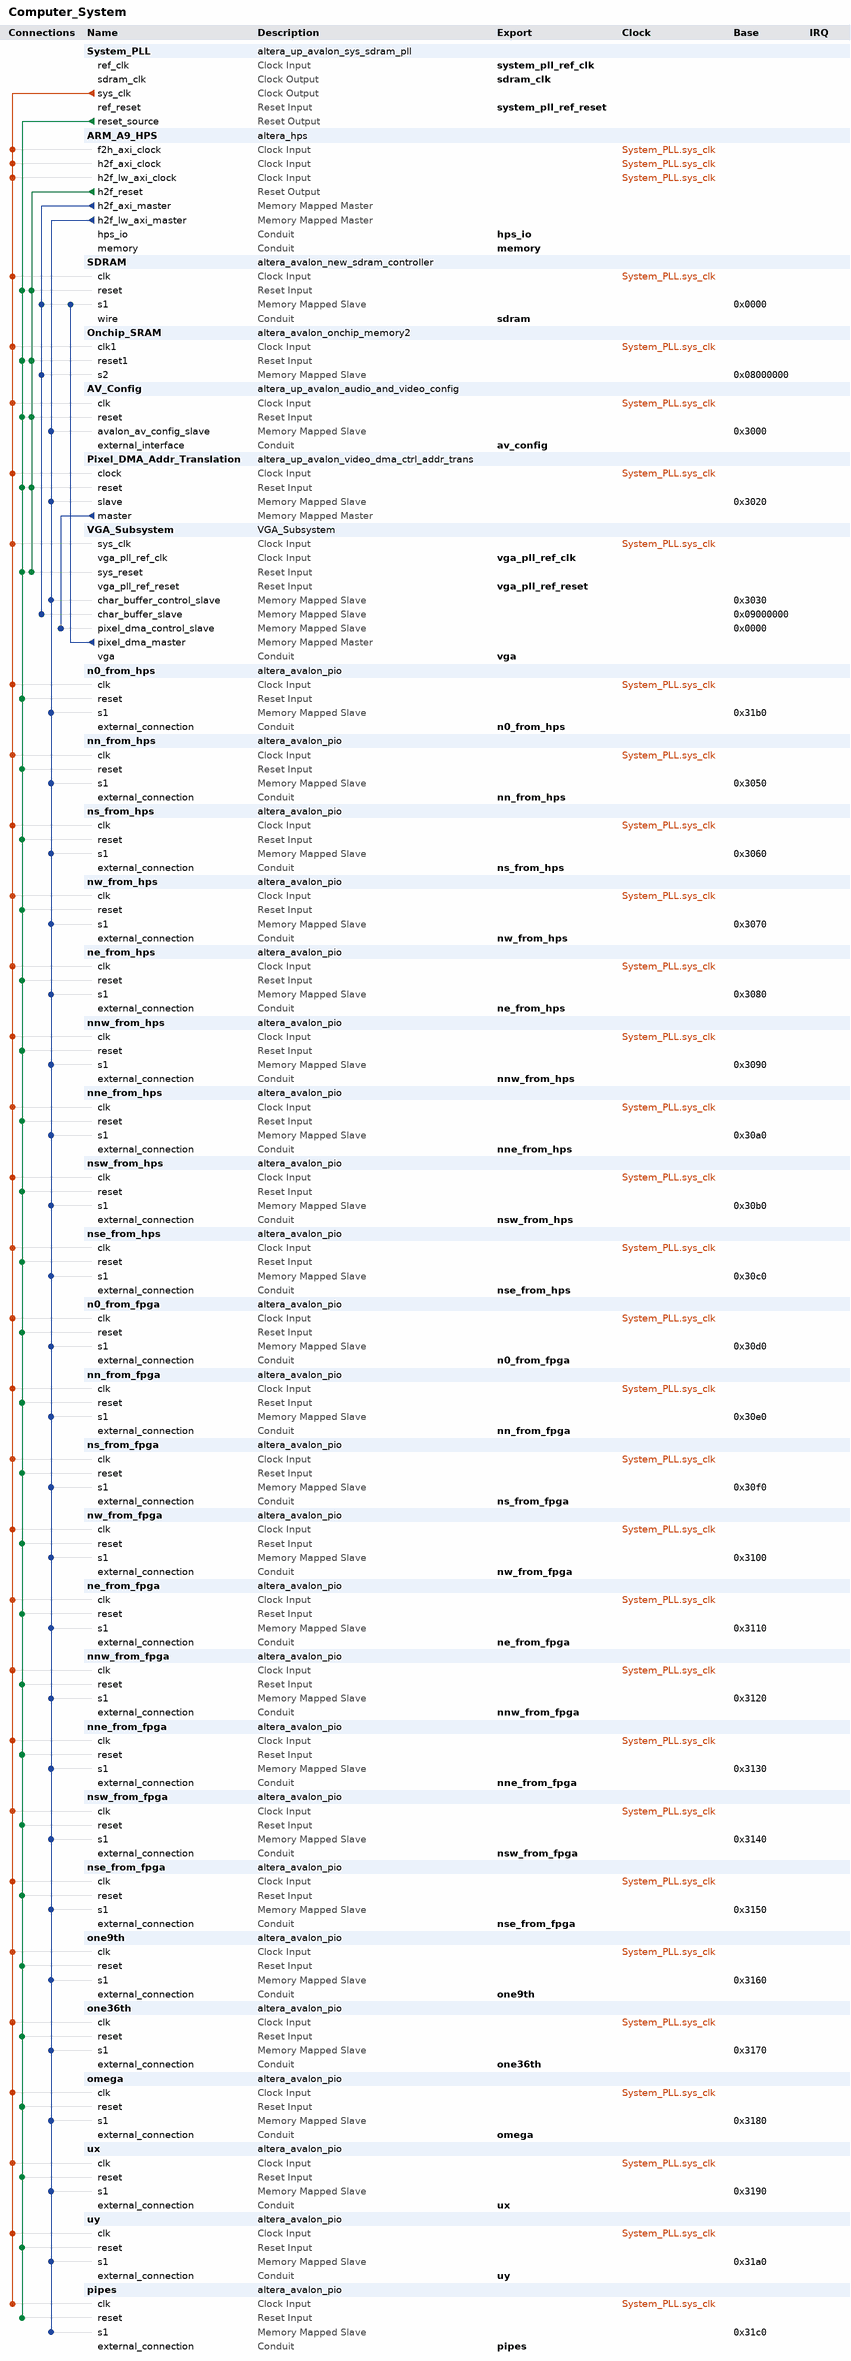
[diagram p0: system contents]
# Platform Designer (Qsys) system Computer_System, Cyclone V 5CSEMA5F31C6
# Parameters at their usual value, and those the tool derives, are not listed.
package require -exact qsys 18.1
create_system Computer_System
set_project_property DEVICE_FAMILY {Cyclone V}
set_project_property DEVICE 5CSEMA5F31C6

add_instance System_PLL altera_up_avalon_sys_sdram_pll 18.0
set_instance_parameter_value System_PLL CV_boards DE1-SoC
set_instance_parameter_value System_PLL gui_outclk 100.0
set_instance_parameter_value System_PLL gui_refclk 50.0

add_instance ARM_A9_HPS altera_hps 18.1
set_instance_parameter_value ARM_A9_HPS EMAC1_Mode RGMII
set_instance_parameter_value ARM_A9_HPS EMAC1_PinMuxing {HPS I/O Set 0}
set_instance_parameter_value ARM_A9_HPS F2SCLK_COLDRST_Enable false
set_instance_parameter_value ARM_A9_HPS F2SCLK_DBGRST_Enable false
set_instance_parameter_value ARM_A9_HPS F2SCLK_WARMRST_Enable false
set_instance_parameter_value ARM_A9_HPS F2SINTERRUPT_Enable true
set_instance_parameter_value ARM_A9_HPS F2S_Width 2
set_instance_parameter_value ARM_A9_HPS FPGA_PERIPHERAL_OUTPUT_CLOCK_FREQ_EMAC0_GTX_CLK 125
set_instance_parameter_value ARM_A9_HPS FPGA_PERIPHERAL_OUTPUT_CLOCK_FREQ_EMAC0_MD_CLK 100.0
set_instance_parameter_value ARM_A9_HPS FPGA_PERIPHERAL_OUTPUT_CLOCK_FREQ_EMAC1_GTX_CLK 125
set_instance_parameter_value ARM_A9_HPS FPGA_PERIPHERAL_OUTPUT_CLOCK_FREQ_EMAC1_MD_CLK 100.0
set_instance_parameter_value ARM_A9_HPS HPS_PROTOCOL DDR3
set_instance_parameter_value ARM_A9_HPS I2C0_Mode I2C
set_instance_parameter_value ARM_A9_HPS I2C0_PinMuxing {HPS I/O Set 0}
set_instance_parameter_value ARM_A9_HPS I2C1_Mode I2C
set_instance_parameter_value ARM_A9_HPS I2C1_PinMuxing {HPS I/O Set 0}
set_instance_parameter_value ARM_A9_HPS LWH2F_Enable true
set_instance_parameter_value ARM_A9_HPS MEM_BANKADDR_WIDTH 3
set_instance_parameter_value ARM_A9_HPS MEM_CLK_FREQ 400.0
set_instance_parameter_value ARM_A9_HPS MEM_COL_ADDR_WIDTH 10
set_instance_parameter_value ARM_A9_HPS MEM_DQ_WIDTH 32
set_instance_parameter_value ARM_A9_HPS MEM_DRV_STR RZQ/7
set_instance_parameter_value ARM_A9_HPS MEM_ROW_ADDR_WIDTH 15
set_instance_parameter_value ARM_A9_HPS MEM_RTT_NOM RZQ/4
set_instance_parameter_value ARM_A9_HPS MEM_RTT_WR RZQ/4
set_instance_parameter_value ARM_A9_HPS MEM_TCL 11
set_instance_parameter_value ARM_A9_HPS MEM_TFAW_NS 30.0
set_instance_parameter_value ARM_A9_HPS MEM_TRAS_NS 35.0
set_instance_parameter_value ARM_A9_HPS MEM_TRCD_NS 13.75
set_instance_parameter_value ARM_A9_HPS MEM_TRFC_NS 260.0
set_instance_parameter_value ARM_A9_HPS MEM_TRP_NS 13.75
set_instance_parameter_value ARM_A9_HPS MEM_VENDOR JEDEC
set_instance_parameter_value ARM_A9_HPS MEM_WTCL 8
set_instance_parameter_value ARM_A9_HPS QSPI_Mode {1 SS}
set_instance_parameter_value ARM_A9_HPS QSPI_PinMuxing {HPS I/O Set 0}
set_instance_parameter_value ARM_A9_HPS REF_CLK_FREQ 25.0
set_instance_parameter_value ARM_A9_HPS S2FCLK_USER2CLK 5
set_instance_parameter_value ARM_A9_HPS S2F_Width 3
set_instance_parameter_value ARM_A9_HPS SDIO_Mode {4-bit Data}
set_instance_parameter_value ARM_A9_HPS SDIO_PinMuxing {HPS I/O Set 0}
set_instance_parameter_value ARM_A9_HPS SPIM1_Mode {Single Slave Select}
set_instance_parameter_value ARM_A9_HPS SPIM1_PinMuxing {HPS I/O Set 0}
set_instance_parameter_value ARM_A9_HPS STM_Enable false
set_instance_parameter_value ARM_A9_HPS TIMING_BOARD_AC_SKEW 0.03
set_instance_parameter_value ARM_A9_HPS TIMING_BOARD_AC_TO_CK_SKEW 0.0
set_instance_parameter_value ARM_A9_HPS TIMING_BOARD_DQ_TO_DQS_SKEW 0.0
set_instance_parameter_value ARM_A9_HPS TIMING_BOARD_MAX_CK_DELAY 0.03
set_instance_parameter_value ARM_A9_HPS TIMING_BOARD_MAX_DQS_DELAY 0.02
set_instance_parameter_value ARM_A9_HPS TIMING_BOARD_SKEW_BETWEEN_DQS 0.08
set_instance_parameter_value ARM_A9_HPS TIMING_BOARD_SKEW_CKDQS_DIMM_MAX 0.16
set_instance_parameter_value ARM_A9_HPS TIMING_BOARD_SKEW_CKDQS_DIMM_MIN 0.09
set_instance_parameter_value ARM_A9_HPS TIMING_BOARD_SKEW_WITHIN_DQS 0.01
set_instance_parameter_value ARM_A9_HPS TIMING_TDH 65
set_instance_parameter_value ARM_A9_HPS TIMING_TDQSCK 255
set_instance_parameter_value ARM_A9_HPS TIMING_TDQSQ 125
set_instance_parameter_value ARM_A9_HPS TIMING_TDS 30
set_instance_parameter_value ARM_A9_HPS TIMING_TIH 140
set_instance_parameter_value ARM_A9_HPS TIMING_TIS 180
set_instance_parameter_value ARM_A9_HPS TIMING_TQSH 0.4
set_instance_parameter_value ARM_A9_HPS UART0_Mode {No Flow Control}
set_instance_parameter_value ARM_A9_HPS UART0_PinMuxing {HPS I/O Set 0}
set_instance_parameter_value ARM_A9_HPS USB1_Mode SDR
set_instance_parameter_value ARM_A9_HPS USB1_PinMuxing {HPS I/O Set 0}
set_instance_parameter_value ARM_A9_HPS desired_cfg_clk_mhz 100.0
set_instance_parameter_value ARM_A9_HPS desired_qspi_clk_mhz 400.0

add_instance SDRAM altera_avalon_new_sdram_controller 18.1
set_instance_parameter_value SDRAM TAC 5.5
set_instance_parameter_value SDRAM TRCD 20.0
set_instance_parameter_value SDRAM TRP 20.0
set_instance_parameter_value SDRAM casLatency 3
set_instance_parameter_value SDRAM columnWidth 10
set_instance_parameter_value SDRAM dataWidth 16
set_instance_parameter_value SDRAM generateSimulationModel true
set_instance_parameter_value SDRAM model single_Micron_MT48LC4M32B2_7_chip
set_instance_parameter_value SDRAM numberOfBanks 4
set_instance_parameter_value SDRAM numberOfChipSelects 1
set_instance_parameter_value SDRAM powerUpDelay 100.0
set_instance_parameter_value SDRAM refreshPeriod 15.625
set_instance_parameter_value SDRAM rowWidth 13

add_instance Onchip_SRAM altera_avalon_onchip_memory2 18.1
set_instance_parameter_value Onchip_SRAM dataWidth 8
set_instance_parameter_value Onchip_SRAM dualPort true
set_instance_parameter_value Onchip_SRAM initMemContent false
set_instance_parameter_value Onchip_SRAM initializationFileName onchip_mem.hex
set_instance_parameter_value Onchip_SRAM memorySize 131072
set_instance_parameter_value Onchip_SRAM singleClockOperation true

add_instance AV_Config altera_up_avalon_audio_and_video_config 18.0
set_instance_parameter_value AV_Config audio_in {Microphone to ADC}
set_instance_parameter_value AV_Config bit_length 32
set_instance_parameter_value AV_Config board DE1-SoC
set_instance_parameter_value AV_Config line_in_bypass false
set_instance_parameter_value AV_Config sampling_rate {48 kHz}

add_instance Pixel_DMA_Addr_Translation altera_up_avalon_video_dma_ctrl_addr_trans 18.0

add_instance VGA_Subsystem VGA_Subsystem 1.0

add_instance n0_from_hps altera_avalon_pio 18.1
set_instance_parameter_value n0_from_hps direction Output
set_instance_parameter_value n0_from_hps width 32

add_instance nn_from_hps altera_avalon_pio 18.1
set_instance_parameter_value nn_from_hps direction Output
set_instance_parameter_value nn_from_hps width 32

add_instance ns_from_hps altera_avalon_pio 18.1
set_instance_parameter_value ns_from_hps direction Output
set_instance_parameter_value ns_from_hps width 32

add_instance nw_from_hps altera_avalon_pio 18.1
set_instance_parameter_value nw_from_hps direction Output
set_instance_parameter_value nw_from_hps width 32

add_instance ne_from_hps altera_avalon_pio 18.1
set_instance_parameter_value ne_from_hps direction Output
set_instance_parameter_value ne_from_hps width 32

add_instance nnw_from_hps altera_avalon_pio 18.1
set_instance_parameter_value nnw_from_hps direction Output
set_instance_parameter_value nnw_from_hps width 32

add_instance nne_from_hps altera_avalon_pio 18.1
set_instance_parameter_value nne_from_hps direction Output
set_instance_parameter_value nne_from_hps width 32

add_instance nsw_from_hps altera_avalon_pio 18.1
set_instance_parameter_value nsw_from_hps direction Output
set_instance_parameter_value nsw_from_hps width 32

add_instance nse_from_hps altera_avalon_pio 18.1
set_instance_parameter_value nse_from_hps direction Output
set_instance_parameter_value nse_from_hps width 32

add_instance n0_from_fpga altera_avalon_pio 18.1
set_instance_parameter_value n0_from_fpga direction Input
set_instance_parameter_value n0_from_fpga width 32

add_instance nn_from_fpga altera_avalon_pio 18.1
set_instance_parameter_value nn_from_fpga direction Input
set_instance_parameter_value nn_from_fpga width 32

add_instance ns_from_fpga altera_avalon_pio 18.1
set_instance_parameter_value ns_from_fpga direction Input
set_instance_parameter_value ns_from_fpga width 32

add_instance nw_from_fpga altera_avalon_pio 18.1
set_instance_parameter_value nw_from_fpga direction Input
set_instance_parameter_value nw_from_fpga width 32

add_instance ne_from_fpga altera_avalon_pio 18.1
set_instance_parameter_value ne_from_fpga direction Input
set_instance_parameter_value ne_from_fpga width 32

add_instance nnw_from_fpga altera_avalon_pio 18.1
set_instance_parameter_value nnw_from_fpga direction Input
set_instance_parameter_value nnw_from_fpga width 32

add_instance nne_from_fpga altera_avalon_pio 18.1
set_instance_parameter_value nne_from_fpga direction Input
set_instance_parameter_value nne_from_fpga width 32

add_instance nsw_from_fpga altera_avalon_pio 18.1
set_instance_parameter_value nsw_from_fpga direction Input
set_instance_parameter_value nsw_from_fpga width 32

add_instance nse_from_fpga altera_avalon_pio 18.1
set_instance_parameter_value nse_from_fpga direction Input
set_instance_parameter_value nse_from_fpga width 32

add_instance one9th altera_avalon_pio 18.1
set_instance_parameter_value one9th direction Output
set_instance_parameter_value one9th width 32

add_instance one36th altera_avalon_pio 18.1
set_instance_parameter_value one36th direction Output
set_instance_parameter_value one36th width 32

add_instance omega altera_avalon_pio 18.1
set_instance_parameter_value omega direction Output
set_instance_parameter_value omega width 32

add_instance ux altera_avalon_pio 18.1
set_instance_parameter_value ux direction Input
set_instance_parameter_value ux width 32

add_instance uy altera_avalon_pio 18.1
set_instance_parameter_value uy direction Input
set_instance_parameter_value uy width 32

add_instance pipes altera_avalon_pio 18.1
set_instance_parameter_value pipes direction Input
set_instance_parameter_value pipes width 32

# connections
add_connection System_PLL.sys_clk ARM_A9_HPS.f2h_axi_clock clock
add_connection System_PLL.sys_clk ARM_A9_HPS.h2f_axi_clock clock
add_connection System_PLL.sys_clk ARM_A9_HPS.h2f_lw_axi_clock clock
add_connection System_PLL.sys_clk AV_Config.clk clock
add_connection System_PLL.sys_clk n0_from_fpga.clk clock
add_connection System_PLL.sys_clk n0_from_hps.clk clock
add_connection System_PLL.sys_clk ne_from_fpga.clk clock
add_connection System_PLL.sys_clk ne_from_hps.clk clock
add_connection System_PLL.sys_clk nn_from_fpga.clk clock
add_connection System_PLL.sys_clk nn_from_hps.clk clock
add_connection System_PLL.sys_clk nne_from_fpga.clk clock
add_connection System_PLL.sys_clk nne_from_hps.clk clock
add_connection System_PLL.sys_clk nnw_from_fpga.clk clock
add_connection System_PLL.sys_clk nnw_from_hps.clk clock
add_connection System_PLL.sys_clk ns_from_fpga.clk clock
add_connection System_PLL.sys_clk ns_from_hps.clk clock
add_connection System_PLL.sys_clk nse_from_fpga.clk clock
add_connection System_PLL.sys_clk nse_from_hps.clk clock
add_connection System_PLL.sys_clk nsw_from_fpga.clk clock
add_connection System_PLL.sys_clk nsw_from_hps.clk clock
add_connection System_PLL.sys_clk nw_from_fpga.clk clock
add_connection System_PLL.sys_clk nw_from_hps.clk clock
add_connection System_PLL.sys_clk omega.clk clock
add_connection System_PLL.sys_clk Onchip_SRAM.clk1 clock
add_connection System_PLL.sys_clk one9th.clk clock
add_connection System_PLL.sys_clk one36th.clk clock
add_connection System_PLL.sys_clk pipes.clk clock
add_connection System_PLL.sys_clk Pixel_DMA_Addr_Translation.clock clock
add_connection System_PLL.sys_clk SDRAM.clk clock
add_connection System_PLL.sys_clk ux.clk clock
add_connection System_PLL.sys_clk uy.clk clock
add_connection System_PLL.sys_clk VGA_Subsystem.sys_clk clock
add_connection ARM_A9_HPS.h2f_reset AV_Config.reset reset
add_connection ARM_A9_HPS.h2f_reset Onchip_SRAM.reset1 reset
add_connection ARM_A9_HPS.h2f_reset Pixel_DMA_Addr_Translation.reset reset
add_connection ARM_A9_HPS.h2f_reset SDRAM.reset reset
add_connection ARM_A9_HPS.h2f_reset VGA_Subsystem.sys_reset reset
add_connection System_PLL.reset_source AV_Config.reset reset
add_connection System_PLL.reset_source n0_from_fpga.reset reset
add_connection System_PLL.reset_source n0_from_hps.reset reset
add_connection System_PLL.reset_source ne_from_fpga.reset reset
add_connection System_PLL.reset_source ne_from_hps.reset reset
add_connection System_PLL.reset_source nn_from_fpga.reset reset
add_connection System_PLL.reset_source nn_from_hps.reset reset
add_connection System_PLL.reset_source nne_from_fpga.reset reset
add_connection System_PLL.reset_source nne_from_hps.reset reset
add_connection System_PLL.reset_source nnw_from_fpga.reset reset
add_connection System_PLL.reset_source nnw_from_hps.reset reset
add_connection System_PLL.reset_source ns_from_fpga.reset reset
add_connection System_PLL.reset_source ns_from_hps.reset reset
add_connection System_PLL.reset_source nse_from_fpga.reset reset
add_connection System_PLL.reset_source nse_from_hps.reset reset
add_connection System_PLL.reset_source nsw_from_fpga.reset reset
add_connection System_PLL.reset_source nsw_from_hps.reset reset
add_connection System_PLL.reset_source nw_from_fpga.reset reset
add_connection System_PLL.reset_source nw_from_hps.reset reset
add_connection System_PLL.reset_source omega.reset reset
add_connection System_PLL.reset_source Onchip_SRAM.reset1 reset
add_connection System_PLL.reset_source one9th.reset reset
add_connection System_PLL.reset_source one36th.reset reset
add_connection System_PLL.reset_source pipes.reset reset
add_connection System_PLL.reset_source Pixel_DMA_Addr_Translation.reset reset
add_connection System_PLL.reset_source SDRAM.reset reset
add_connection System_PLL.reset_source ux.reset reset
add_connection System_PLL.reset_source uy.reset reset
add_connection System_PLL.reset_source VGA_Subsystem.sys_reset reset
add_connection ARM_A9_HPS.h2f_axi_master Onchip_SRAM.s2 avalon
set_connection_parameter_value ARM_A9_HPS.h2f_axi_master/Onchip_SRAM.s2 baseAddress 0x08000000
add_connection ARM_A9_HPS.h2f_axi_master SDRAM.s1 avalon
set_connection_parameter_value ARM_A9_HPS.h2f_axi_master/SDRAM.s1 baseAddress 0x0000
add_connection ARM_A9_HPS.h2f_axi_master VGA_Subsystem.char_buffer_slave avalon
set_connection_parameter_value ARM_A9_HPS.h2f_axi_master/VGA_Subsystem.char_buffer_slave baseAddress 0x09000000
add_connection ARM_A9_HPS.h2f_lw_axi_master AV_Config.avalon_av_config_slave avalon
set_connection_parameter_value ARM_A9_HPS.h2f_lw_axi_master/AV_Config.avalon_av_config_slave baseAddress 0x3000
add_connection ARM_A9_HPS.h2f_lw_axi_master n0_from_fpga.s1 avalon
set_connection_parameter_value ARM_A9_HPS.h2f_lw_axi_master/n0_from_fpga.s1 baseAddress 0x30d0
add_connection ARM_A9_HPS.h2f_lw_axi_master n0_from_hps.s1 avalon
set_connection_parameter_value ARM_A9_HPS.h2f_lw_axi_master/n0_from_hps.s1 baseAddress 0x31b0
add_connection ARM_A9_HPS.h2f_lw_axi_master ne_from_fpga.s1 avalon
set_connection_parameter_value ARM_A9_HPS.h2f_lw_axi_master/ne_from_fpga.s1 baseAddress 0x3110
add_connection ARM_A9_HPS.h2f_lw_axi_master ne_from_hps.s1 avalon
set_connection_parameter_value ARM_A9_HPS.h2f_lw_axi_master/ne_from_hps.s1 baseAddress 0x3080
add_connection ARM_A9_HPS.h2f_lw_axi_master nn_from_fpga.s1 avalon
set_connection_parameter_value ARM_A9_HPS.h2f_lw_axi_master/nn_from_fpga.s1 baseAddress 0x30e0
add_connection ARM_A9_HPS.h2f_lw_axi_master nn_from_hps.s1 avalon
set_connection_parameter_value ARM_A9_HPS.h2f_lw_axi_master/nn_from_hps.s1 baseAddress 0x3050
add_connection ARM_A9_HPS.h2f_lw_axi_master nne_from_fpga.s1 avalon
set_connection_parameter_value ARM_A9_HPS.h2f_lw_axi_master/nne_from_fpga.s1 baseAddress 0x3130
add_connection ARM_A9_HPS.h2f_lw_axi_master nne_from_hps.s1 avalon
set_connection_parameter_value ARM_A9_HPS.h2f_lw_axi_master/nne_from_hps.s1 baseAddress 0x30a0
add_connection ARM_A9_HPS.h2f_lw_axi_master nnw_from_fpga.s1 avalon
set_connection_parameter_value ARM_A9_HPS.h2f_lw_axi_master/nnw_from_fpga.s1 baseAddress 0x3120
add_connection ARM_A9_HPS.h2f_lw_axi_master nnw_from_hps.s1 avalon
set_connection_parameter_value ARM_A9_HPS.h2f_lw_axi_master/nnw_from_hps.s1 baseAddress 0x3090
add_connection ARM_A9_HPS.h2f_lw_axi_master ns_from_fpga.s1 avalon
set_connection_parameter_value ARM_A9_HPS.h2f_lw_axi_master/ns_from_fpga.s1 baseAddress 0x30f0
add_connection ARM_A9_HPS.h2f_lw_axi_master ns_from_hps.s1 avalon
set_connection_parameter_value ARM_A9_HPS.h2f_lw_axi_master/ns_from_hps.s1 baseAddress 0x3060
add_connection ARM_A9_HPS.h2f_lw_axi_master nse_from_fpga.s1 avalon
set_connection_parameter_value ARM_A9_HPS.h2f_lw_axi_master/nse_from_fpga.s1 baseAddress 0x3150
add_connection ARM_A9_HPS.h2f_lw_axi_master nse_from_hps.s1 avalon
set_connection_parameter_value ARM_A9_HPS.h2f_lw_axi_master/nse_from_hps.s1 baseAddress 0x30c0
add_connection ARM_A9_HPS.h2f_lw_axi_master nsw_from_fpga.s1 avalon
set_connection_parameter_value ARM_A9_HPS.h2f_lw_axi_master/nsw_from_fpga.s1 baseAddress 0x3140
add_connection ARM_A9_HPS.h2f_lw_axi_master nsw_from_hps.s1 avalon
set_connection_parameter_value ARM_A9_HPS.h2f_lw_axi_master/nsw_from_hps.s1 baseAddress 0x30b0
add_connection ARM_A9_HPS.h2f_lw_axi_master nw_from_fpga.s1 avalon
set_connection_parameter_value ARM_A9_HPS.h2f_lw_axi_master/nw_from_fpga.s1 baseAddress 0x3100
add_connection ARM_A9_HPS.h2f_lw_axi_master nw_from_hps.s1 avalon
set_connection_parameter_value ARM_A9_HPS.h2f_lw_axi_master/nw_from_hps.s1 baseAddress 0x3070
add_connection ARM_A9_HPS.h2f_lw_axi_master omega.s1 avalon
set_connection_parameter_value ARM_A9_HPS.h2f_lw_axi_master/omega.s1 baseAddress 0x3180
add_connection ARM_A9_HPS.h2f_lw_axi_master one9th.s1 avalon
set_connection_parameter_value ARM_A9_HPS.h2f_lw_axi_master/one9th.s1 baseAddress 0x3160
add_connection ARM_A9_HPS.h2f_lw_axi_master one36th.s1 avalon
set_connection_parameter_value ARM_A9_HPS.h2f_lw_axi_master/one36th.s1 baseAddress 0x3170
add_connection ARM_A9_HPS.h2f_lw_axi_master pipes.s1 avalon
set_connection_parameter_value ARM_A9_HPS.h2f_lw_axi_master/pipes.s1 baseAddress 0x31c0
add_connection ARM_A9_HPS.h2f_lw_axi_master Pixel_DMA_Addr_Translation.slave avalon
set_connection_parameter_value ARM_A9_HPS.h2f_lw_axi_master/Pixel_DMA_Addr_Translation.slave baseAddress 0x3020
add_connection ARM_A9_HPS.h2f_lw_axi_master ux.s1 avalon
set_connection_parameter_value ARM_A9_HPS.h2f_lw_axi_master/ux.s1 baseAddress 0x3190
add_connection ARM_A9_HPS.h2f_lw_axi_master uy.s1 avalon
set_connection_parameter_value ARM_A9_HPS.h2f_lw_axi_master/uy.s1 baseAddress 0x31a0
add_connection ARM_A9_HPS.h2f_lw_axi_master VGA_Subsystem.char_buffer_control_slave avalon
set_connection_parameter_value ARM_A9_HPS.h2f_lw_axi_master/VGA_Subsystem.char_buffer_control_slave baseAddress 0x3030
add_connection Pixel_DMA_Addr_Translation.master VGA_Subsystem.pixel_dma_control_slave avalon
set_connection_parameter_value Pixel_DMA_Addr_Translation.master/VGA_Subsystem.pixel_dma_control_slave baseAddress 0x0000
add_connection VGA_Subsystem.pixel_dma_master SDRAM.s1 avalon
set_connection_parameter_value VGA_Subsystem.pixel_dma_master/SDRAM.s1 baseAddress 0x0000

# exported interfaces
add_interface av_config conduit end
set_interface_property av_config EXPORT_OF AV_Config.external_interface
add_interface hps_io conduit end
set_interface_property hps_io EXPORT_OF ARM_A9_HPS.hps_io
add_interface memory conduit end
set_interface_property memory EXPORT_OF ARM_A9_HPS.memory
add_interface n0_from_fpga conduit end
set_interface_property n0_from_fpga EXPORT_OF n0_from_fpga.external_connection
add_interface n0_from_hps conduit end
set_interface_property n0_from_hps EXPORT_OF n0_from_hps.external_connection
add_interface ne_from_fpga conduit end
set_interface_property ne_from_fpga EXPORT_OF ne_from_fpga.external_connection
add_interface ne_from_hps conduit end
set_interface_property ne_from_hps EXPORT_OF ne_from_hps.external_connection
add_interface nn_from_fpga conduit end
set_interface_property nn_from_fpga EXPORT_OF nn_from_fpga.external_connection
add_interface nn_from_hps conduit end
set_interface_property nn_from_hps EXPORT_OF nn_from_hps.external_connection
add_interface nne_from_fpga conduit end
set_interface_property nne_from_fpga EXPORT_OF nne_from_fpga.external_connection
add_interface nne_from_hps conduit end
set_interface_property nne_from_hps EXPORT_OF nne_from_hps.external_connection
add_interface nnw_from_fpga conduit end
set_interface_property nnw_from_fpga EXPORT_OF nnw_from_fpga.external_connection
add_interface nnw_from_hps conduit end
set_interface_property nnw_from_hps EXPORT_OF nnw_from_hps.external_connection
add_interface ns_from_fpga conduit end
set_interface_property ns_from_fpga EXPORT_OF ns_from_fpga.external_connection
add_interface ns_from_hps conduit end
set_interface_property ns_from_hps EXPORT_OF ns_from_hps.external_connection
add_interface nse_from_fpga conduit end
set_interface_property nse_from_fpga EXPORT_OF nse_from_fpga.external_connection
add_interface nse_from_hps conduit end
set_interface_property nse_from_hps EXPORT_OF nse_from_hps.external_connection
add_interface nsw_from_fpga conduit end
set_interface_property nsw_from_fpga EXPORT_OF nsw_from_fpga.external_connection
add_interface nsw_from_hps conduit end
set_interface_property nsw_from_hps EXPORT_OF nsw_from_hps.external_connection
add_interface nw_from_fpga conduit end
set_interface_property nw_from_fpga EXPORT_OF nw_from_fpga.external_connection
add_interface nw_from_hps conduit end
set_interface_property nw_from_hps EXPORT_OF nw_from_hps.external_connection
add_interface omega conduit end
set_interface_property omega EXPORT_OF omega.external_connection
add_interface one36th conduit end
set_interface_property one36th EXPORT_OF one36th.external_connection
add_interface one9th conduit end
set_interface_property one9th EXPORT_OF one9th.external_connection
add_interface pipes conduit end
set_interface_property pipes EXPORT_OF pipes.external_connection
add_interface sdram conduit end
set_interface_property sdram EXPORT_OF SDRAM.wire
add_interface sdram_clk clock source
set_interface_property sdram_clk EXPORT_OF System_PLL.sdram_clk
add_interface system_pll_ref_clk clock sink
set_interface_property system_pll_ref_clk EXPORT_OF System_PLL.ref_clk
add_interface system_pll_ref_reset reset sink
set_interface_property system_pll_ref_reset EXPORT_OF System_PLL.ref_reset
add_interface ux conduit end
set_interface_property ux EXPORT_OF ux.external_connection
add_interface uy conduit end
set_interface_property uy EXPORT_OF uy.external_connection
add_interface vga conduit end
set_interface_property vga EXPORT_OF VGA_Subsystem.vga
add_interface vga_pll_ref_clk clock sink
set_interface_property vga_pll_ref_clk EXPORT_OF VGA_Subsystem.vga_pll_ref_clk
add_interface vga_pll_ref_reset reset sink
set_interface_property vga_pll_ref_reset EXPORT_OF VGA_Subsystem.vga_pll_ref_reset

set_interconnect_requirement {$system} qsys_mm.clockCrossingAdapter HANDSHAKE
set_interconnect_requirement {$system} qsys_mm.enableEccProtection FALSE
set_interconnect_requirement {$system} qsys_mm.insertDefaultSlave FALSE
set_interconnect_requirement {$system} qsys_mm.maxAdditionalLatency 1

save_system Computer_System.qsys
